# EasyEDA schematic EasyEDA_Schematic_ES1050 T11Bees Beehive Health Monitoring System_2022-03-30.json
TITLE: 5V Power Circuit (Solar+Batt) & Sensors Circuit; REV: 1.0; Date: 2022-03-30; Sheet: 1/1; Drawn By: Lukas Adie; Company: T11Bees
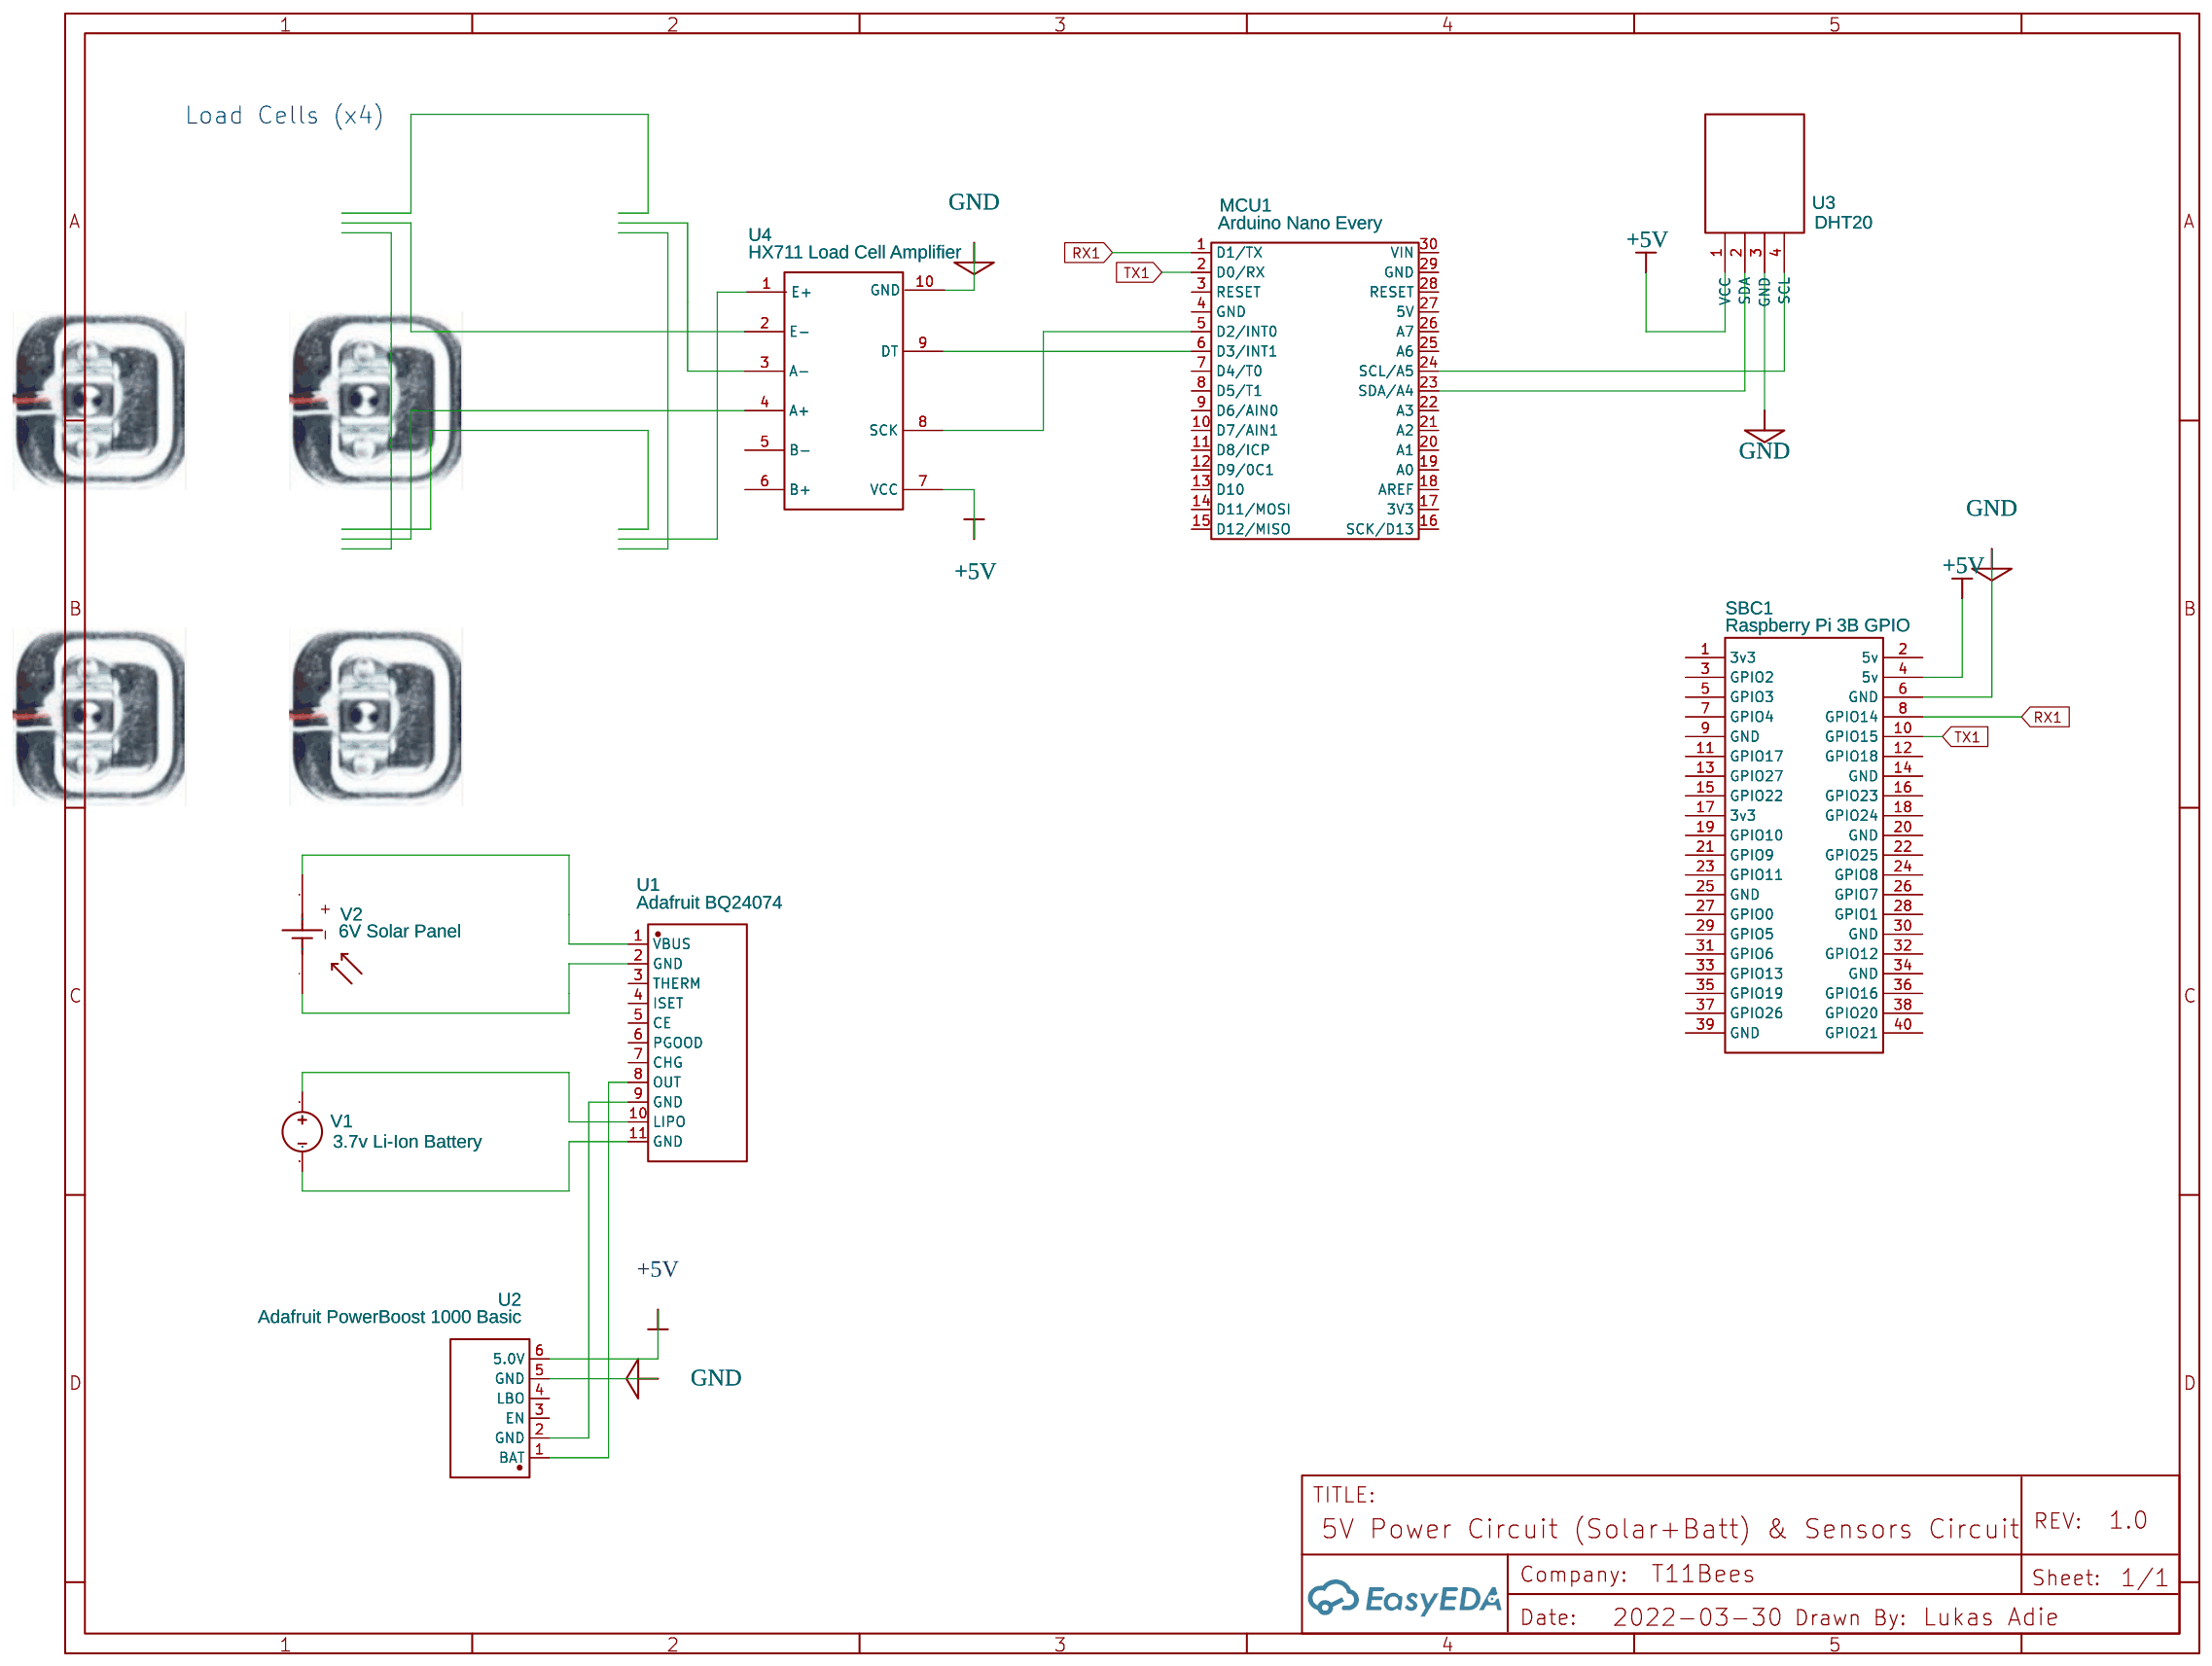
[diagram p0: schematic sheet]

## Parts
MCU1  Arduino Nano Every  [DIP-30_L43.18-W15.24-ARDUINONANO]
SBC1  Raspberry Pi 3B GPIO  [2X20_2.54_HEADER]
U1  Adafruit BQ24074
U2  Adafruit PowerBoost 1000 Basic
U3  DHT20  [AM2108_DHT20]
U4  HX711 Load Cell Amplifier  [LOADCELL_HX711]
V1  3.7v Li-Ion Battery  [2P-5.0]
V2  6V Solar Panel  [SOLARBIT-12X1]

## Library data of the parts
MCU1 = Arduino_Nano_Header
SBC1 = RPI3B+_HEADER COPY: Contributor: boulou; Package Display: No
U1 = Adafruit BQ24074
U2 = Adafruit PowerBoost 1000 Basic
U3 = AM2108_DHT20: Supplier: berrybase; Contributor: pcbpanda
U4 = LOADCELL_HX711: Manufacturer Part: HX711; Supplier Part: HX711; Supplier: AVIA Semiconductor; Contributor: Alexander Kocian
V1 = VOLTAGE_SOURCE: link: http://ngspice.sourceforge.net/docs/ngspice-manual.pdf#chapter.4
V2 = solar panel: Contributor: dima_xxx71

## Nets
+5V: SBC1.4(5v) U2.6(5.0V) U3.1(VCC) U4.7(VCC)
GND: SBC1.6(GND) U2.5(GND) U3.3(GND) U4.10(GND)
RX1: MCU1.1(D1/TX) SBC1.8(GPIO14)
TX1: MCU1.2(D0/RX) SBC1.10(GPIO15)
Net-(MCU1-5): MCU1.5(D2/INT0) U4.8(SCK)
Net-(MCU1-6): MCU1.6(D3/INT1) U4.9(DT)
Net-(MCU1-23): MCU1.23(SDA/A4) U3.2(SDA)
Net-(MCU1-24): MCU1.24(SCL/A5) U3.4(SCL)
Net-(U1-1): U1.1(VBUS) V2.+(A)
Net-(U1-2): U1.2(GND) V2.-(C)
Net-(U1-8): U1.8(OUT) U2.1(BAT)
Net-(U1-9): U1.9(GND) U2.2(GND)
Net-(U1-10): U1.10(LIPO) V1.1
Net-(U1-11): U1.11(GND) V1.2

Not connected (* = marked no-connect by the designer): MCU1 3(RESET) 4(GND) 7(D4/T0) 8(D5/T1) 9(D6/AIN0) 10(D7/AIN1) 11(D8/ICP) 12(D9/0C1) 13(D10) 14(D11/MOSI) 15(D12/MISO) 16(SCK/D13) 17(3V3) 18(AREF) 19(A0) 20(A1) 21(A2) 22(A3) 25(A6) 26(A7) 27(5V) 28(RESET) 29(GND) 30(VIN); SBC1 1(3v3) 2(5v) 3(GPIO2) 5(GPIO3) 7(GPIO4) 9(GND) 11(GPIO17) 12(GPIO18) 13(GPIO27) 14(GND) 15(GPIO22) 16(GPIO23) 17(3v3) 18(GPIO24) 19(GPIO10) 20(GND) 21(GPIO9) 22(GPIO25) 23(GPIO11) 24(GPIO8) 25(GND) 26(GPIO7) 27(GPIO0) 28(GPIO1) 29(GPIO5) 30(GND) 31(GPIO6) 32(GPIO12) 33(GPIO13) 34(GND) 35(GPIO19) 36(GPIO16) 37(GPIO26) 38(GPIO20) 39(GND) 40(GPIO21); U1 3(THERM) 4(ISET) 5(CE) 6(PGOOD) 7(CHG); U2 3(EN) 4(LBO); U4 1(E+) 2(E-) 3(A-) 4(A+) 5(B-) 6(B+)

## Notes on the sheet
- Load Cells (x4)
